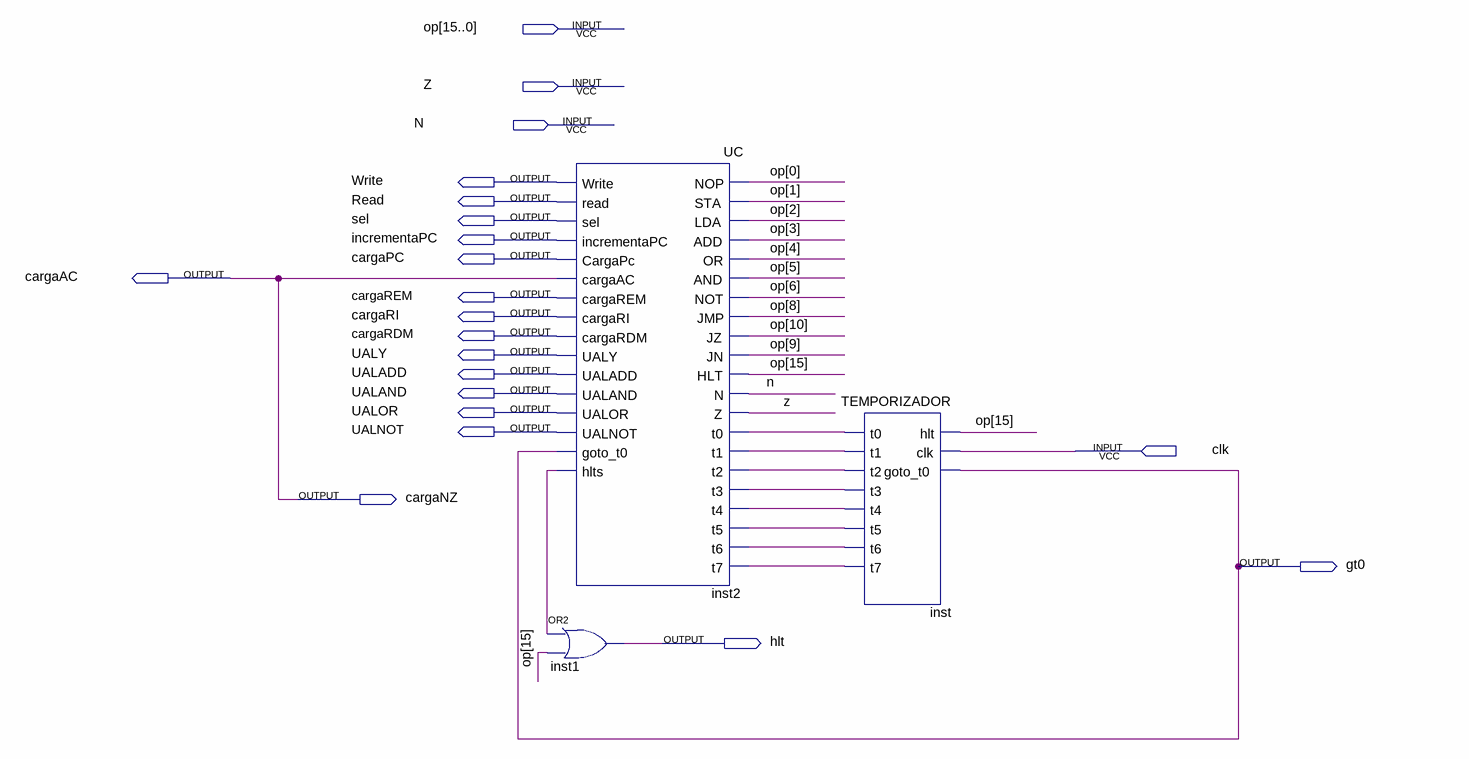
[diagram p0: schematic sheet]
// Quartus schematic UnidadeControle.bdf as structural Verilog: 3 symbols, 21 pins
module UnidadeControle (
  input  [15:0] op,
  input  Z,
  input  N,
  input  clk,
  output Write,
  output Read,
  output sel,
  output incrementaPC,
  output cargaPC,
  output cargaAC,
  output cargaREM,
  output cargaRI,
  output cargaRDM,
  output UALY,
  output UALADD,
  output UALAND,
  output UALOR,
  output UALNOT,
  output cargaNZ,
  output gt0,
  output hlt
);

  wire inst2_hlts, inst_t0, inst_t1, inst_t2, inst_t3, inst_t4, inst_t5, inst_t6, inst_t7;

  UC inst2 (
    .NOP(op[0]), .STA(op[1]), .LDA(op[2]), .ADD(op[3]), .OR(op[4]), .AND(op[5]), .NOT(op[6]), .JMP(op[8]),
    .JZ(op[10]), .JN(op[9]), .HLT(op[15]), .N(N), .Z(Z), .t0(inst_t0), .t1(inst_t1), .t2(inst_t2),
    .t3(inst_t3), .t4(inst_t4), .t5(inst_t5), .t6(inst_t6), .t7(inst_t7), .Write(Write), .read(Read),
    .sel(sel), .incrementaPC(incrementaPC), .CargaPc(cargaPC), .cargaAC(cargaAC), .cargaREM(cargaREM),
    .cargaRI(cargaRI), .cargaRDM(cargaRDM), .UALY(UALY), .UALADD(UALADD), .UALAND(UALAND), .UALOR(UALOR),
    .UALNOT(UALNOT), .goto_t0(gt0), .hlts(inst2_hlts));
  or inst1 (hlt, inst2_hlts, op[15]);
  TEMPORIZADOR inst (
    .hlt(op[15]), .clk(clk), .goto_t0(gt0), .t0(inst_t0), .t1(inst_t1), .t2(inst_t2), .t3(inst_t3),
    .t4(inst_t4), .t5(inst_t5), .t6(inst_t6), .t7(inst_t7));

  assign cargaNZ = cargaAC;
endmodule
